# Altium schematic sheet sustentationAvecPC.SchDoc
size A4; Organization: ECAM; Revision: 0; SheetNumber: 1; SheetTotal: 1
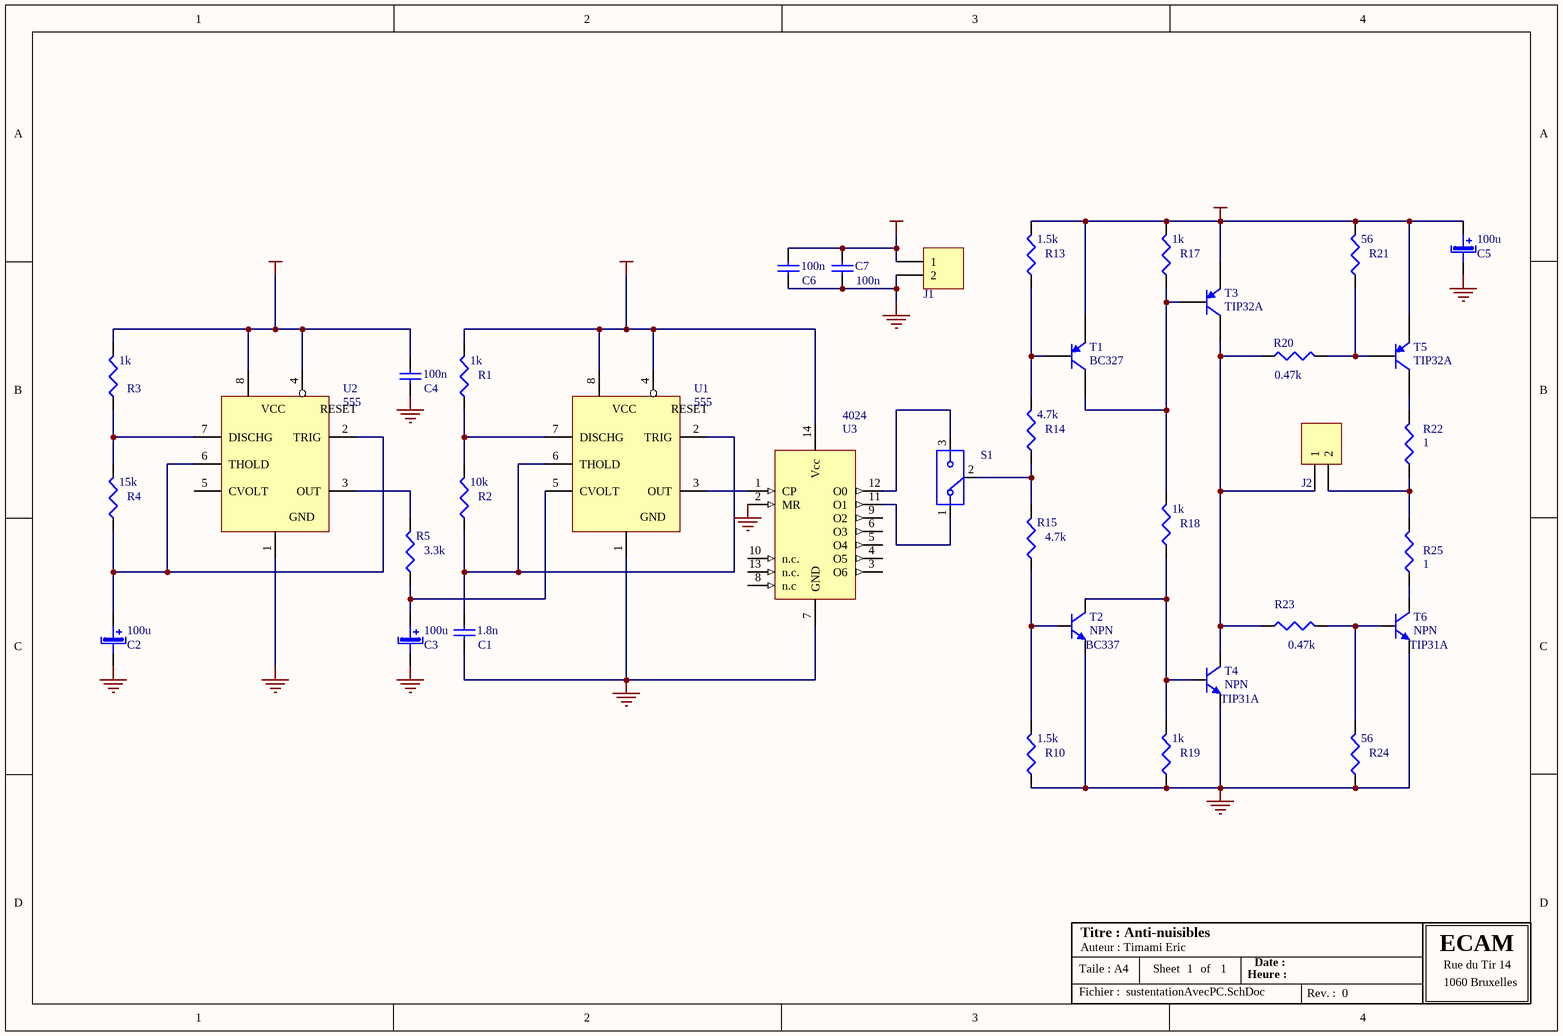
[diagram p0: sustentationAvecPC.SchDoc]

## Parts
C1  value 1.8n  [Capa_1.8n]  (hidden comment: Condensateur)
C2  value 100u  [CAPPR_100n]  (hidden comment: Cond pol radial)
C3  value 100u  [CAPPR_100n]  (hidden comment: Cond pol radial)
C4  value 100n  [cap100n]  (hidden comment: Condensateur)
C5  value 100u  [CAPPR_100n]  (hidden comment: Cond pol radial)
C6  value 100n  [cap100n]  (hidden comment: Condensateur)
C7  value 100n  [cap100n]  (hidden comment: Condensateur)
J1  Connecteur 2  [CONVIS-2]  (value not drawn)
J2  Connecteur 2  [CONVIS-2]  (value not drawn)
R1  value 1k  [AXIAL-0.4]  (hidden comment: Résistance)
R2  value 10k  [AXIAL-0.4]  (hidden comment: Résistance)
R3  value 1k  [AXIAL-0.4]  (hidden comment: Résistance)
R4  value 15k  [AXIAL-0.4]  (hidden comment: Résistance)
R5  value 3.3k  [AXIAL-0.4]  (hidden comment: Résistance)
R10  value 1.5k  [AXIAL-0.4]  (hidden comment: Résistance)
R13  value 1.5k  [AXIAL-0.4]  (hidden comment: Résistance)
R14  value 4.7k  [AXIAL-0.4]  (hidden comment: Résistance)
R15  value 4.7k  [AXIAL-0.4]  (hidden comment: Résistance)
R17  value 1k  [AXIAL-0.4]  (hidden comment: Résistance)
R18  value 1k  [AXIAL-0.4]  (hidden comment: Résistance)
R19  value 1k  [AXIAL-0.4]  (hidden comment: Résistance)
R20  value 0.47k  [AXIAL-0.4_vertical- ]  (hidden comment: Résistance)
R21  value 56  [AXIAL-0.4]  (hidden comment: Résistance)
R22  value 1  [AXIAL-0.5_de_puissance]  (hidden comment: Résistance)
R23  value 0.47k  [AXIAL-0.4_vertical- ]  (hidden comment: Résistance)
R24  value 56  [AXIAL-0.4]  (hidden comment: Résistance)
R25  value 1  [AXIAL-0.5_de_puissance]  (hidden comment: Résistance)
S1  DIP Inverseur  [SIP3]  (value not drawn)
T1  BC327  [TO-226AE_BC327]
T2  BC337  value NPN  [TO-226AE_BC327]
T3  TIP32A  [TO-220]
T4  TIP31A  value NPN  [TO-220]
T5  TIP32A  [TO-220]
T6  TIP31A  value NPN  [TO-220]
U1  555  [DIP8]
U2  555  [DIP8]
U3  4024  [DIP14]

## Nets
GND: C1.2 C2.2(-) C3.2(-) C4.2 C5.2(-) C6.2 C7.2 J1.2 R10.1 R19.1 R24.1 T2.3(E) T4.3(E) T6.3(E) U1.1(GND) U2.1(GND) U3.2(MR) U3.7(GND)
VCC: C4.1 C5.1(+) C6.1 C7.1 J1.1 R1.2 R3.2 R13.2 R17.2 R21.2 T1.1(E) T3.3(E) T5.3(E) U1.4(RESET) U1.8(VCC) U2.4(RESET) U2.8(VCC) U3.14(Vcc)
NetC1_1: C1.1 R2.1 U1.2(TRIG) U1.6(THOLD)
NetC2_1: C2.1(+) R4.1 U2.2(TRIG) U2.6(THOLD)
NetC3_1: C3.1(+) R5.1 U1.5(CVOLT)
NetJ2_1: J2.1 R20.1 R23.1 T3.2(C) T4.2(C)
NetJ2_2: J2.2 R22.1 R25.2
NetR1_1: R1.1 R2.2 U1.7(DISCHG)
NetR3_1: R3.1 R4.2 U2.7(DISCHG)
NetR5_2: R5.2 U2.3(OUT)
NetR10_2: R10.2 R15.1 T2.2(B)
NetR13_1: R13.1 R14.2 T1.2(B)
NetR14_1: R14.1 R15.2 S1.2(COM)
NetR17_1: R17.1 R18.2 T1.3(C) T3.1(B)
NetR18_1: R18.1 R19.2 T2.1(C) T4.1(B)
NetR20_2: R20.2 R21.1 T5.1(B)
NetR22_2: R22.2 T5.2(C)
NetR23_2: R23.2 R24.2 T6.1(B)
NetR25_1: R25.1 T6.2(C)
NetS1_1: S1.1(TA) U3.11(O1)
NetS1_3: S1.3(TB) U3.12(O0)
NetU1_3: U1.3(OUT) U3.1(CP)

Not connected (* = marked no-connect by the designer): U2 5(CVOLT); U3 3(O6) 4(O5) 5(O4) 6(O3) 8(n.c) 9(O2) 10(n.c.) 13(n.c.)

## Notes on the sheet
- Taile : A4
- Titre : Anti-nuisibles
- Auteur : Timami Eric
- Sheet
- of
- Heure :
- Date :
- ECAM
- Rue du Tir 14
- 1060 Bruxelles
- Fichier :
- Rev. :

## Library data of the parts
C2 C3 C5 = Cond pol radial: Condensateur polatisé; Type: Condensateur polarisé debout; Designer: ECAM 2004
J1 J2 = Connecteur 2: Connecteur; Designer: ECAM 2005; Type: Connecteur à vis
R1-R5 R10 R13-R15 R17-R25 = Résistance: Résistance standard; Designer: ECAM 2005; Type: Résistance standard
S1 = DIP Inverseur: Inverseur; Supplier: Farnell 674 345; Designer: ECAM 2003; Type: Switch slide SPDT vertical
T1 = BDL32_1: PNP BISS-Transistor; Note: Pin 2 is not connected and is not drawn.; Published: 17-Sep-2003; DatasheetDocument: 29-Apr-1999; PackageDocument: Aug-2001; PackageReference: SOT223; Publisher: Altium Limited; ComponentLink1Description: Manufacturer Link; ComponentLink1URL: http://www.semiconductors.philips.com/; ComponentLink2Description: Datasheet; ComponentLink2URL: http://www.semiconductors.philips.com/acrobat/datasheets/BDL32_4.pdf
T2 = NPN_1: Transistor Bipolaire; Type: Transistor Bipolaire NPN; Designer: ECAM 2002
T3 T5 = BDL32: PNP BISS-Transistor; Note: Pin 2 is not connected and is not drawn.; Published: 17-Sep-2003; DatasheetDocument: 29-Apr-1999; PackageDocument: Aug-2001; PackageReference: SOT223; Publisher: Altium Limited; ComponentLink1Description: Manufacturer Link; ComponentLink1URL: http://www.semiconductors.philips.com/; ComponentLink2Description: Datasheet; ComponentLink2URL: http://www.semiconductors.philips.com/acrobat/datasheets/BDL32_4.pdf
T4 T6 = NPN_2: Transistor Bipolaire; Type: Transistor Bipolaire NPN; Designer: ECAM 2002
U1 U2 = 555: Timer
U3 = 4024: compteur; Published: 8-Jun-2000; LatestRevisionDate: 17-Jul-2002; LatestRevisionNote: Re-released for DXP Platform.; DatasheetDocument: Jul-1996; PackageDocument: Jan-1998; PackageReference: D016; Publisher: Altium Limited
C1 C4 C6 C7 = Condensateur: Supplier: Farnell; Designer: ECAM 2004